# EAGLE schematic Schematic (EAGLE 6.6.0)
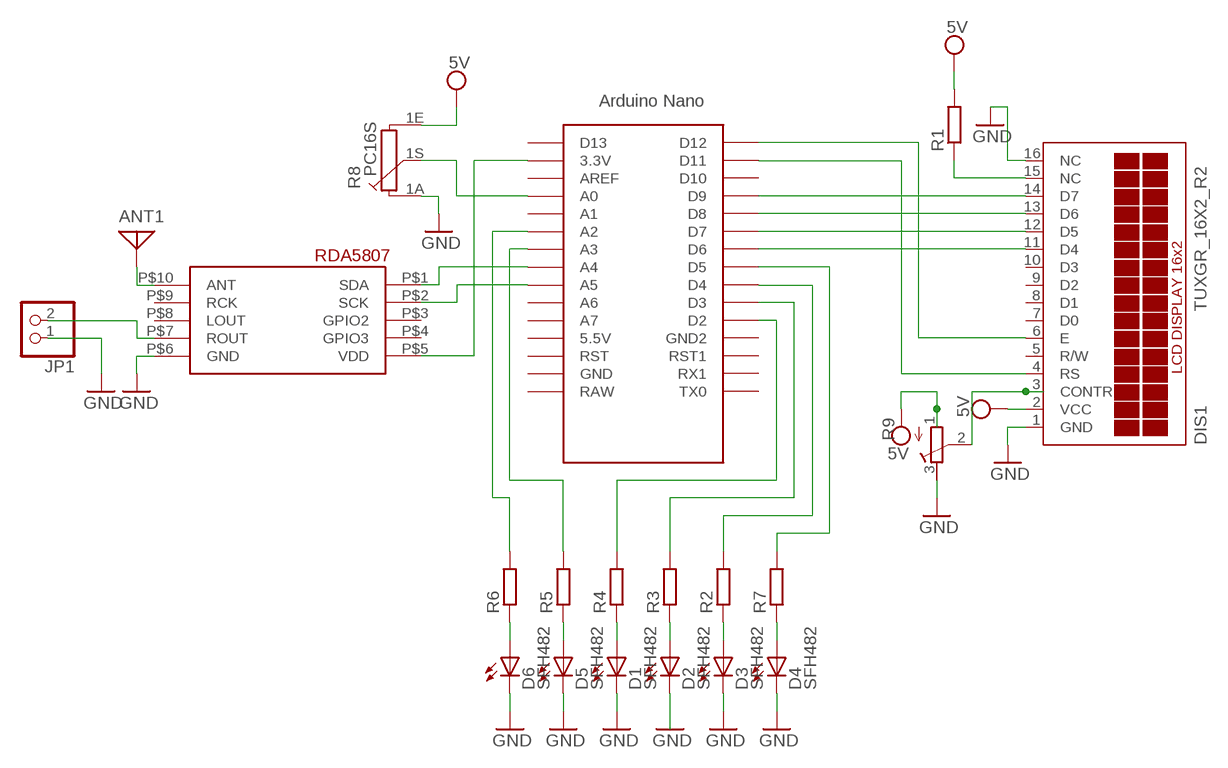
[diagram p0: schematic, sheet 1]

## Parts
ANT1  ANTENNA  [PAD-01]
D1  SFH482  [SFH482]
D2  SFH482  [SFH482]
D3  SFH482  [SFH482]
D4  SFH482  [SFH482]
D5  SFH482  [SFH482]
D6  SFH482  [SFH482]
DIS1  TUXGR_16X2_R2  [TUXGR_16X2_R2]
JP1  PINHD-1X2  [1X02]
R1  R-EU_0207/10  [0207/10]
R2  R-EU_0207/10  [0207/10]
R3  R-EU_0207/10  [0207/10]
R4  R-EU_0207/10  [0207/10]
R5  R-EU_0207/10  [0207/10]
R6  R-EU_0207/10  [0207/10]
R7  R-EU_0207/10  [0207/10]
R8  PC16S  [PC16S]
R9  R-TRIMM3339P  [RTRIM3339P]
U$1  NANO  [NANO]
U$3  RDA5807  [RDA5807]

## Nets
GND: D1.K(C) D2.K(C) D3.K(C) D4.K(C) D5.K(C) D6.K(C) DIS1.1(GND) DIS1.16(NC) JP1.1 R8.1A R9.3(A) U$3.P$6(GND)
N$1: D6.A R6.1
N$2: D5.A R5.1
N$3: D1.A R4.1
N$4: D2.A R3.1
N$5: D3.A R2.1
N$6: D4.A R7.1
N$7: DIS1.11(D4) U$1.D6
N$8: U$1.A5 U$3.P$2(SCK)
N$9: JP1.2 U$3.P$7(ROUT)
N$10: DIS1.12(D5) U$1.D7
N$11: R8.1S U$1.A0
N$12: DIS1.13(D6) U$1.D8
N$13: DIS1.14(D7) U$1.D9
N$14: DIS1.3(CONTR) R9.2(S)
N$15: DIS1.6(E) U$1.D12
N$16: DIS1.4(RS) U$1.D11
N$17: R4.2 U$1.D2
N$18: R3.2 U$1.D3
N$19: R2.2 U$1.D4
N$20: R7.2 U$1.D5
N$21: R5.2 U$1.A3
N$22: R6.2 U$1.A2
N$24: DIS1.15(NC) R1.1
N$28: U$1.3.3V U$3.P$5(VDD)
N$29: ANT1.1 U$3.P$10(ANT)
N$33: U$1.A4 U$3.P$1(SDA)
VSS: DIS1.2(VCC) R1.2 R8.1E R9.1(E) ; supply symbol labelled 5V
Unconnected: DIS1.5(R/W) DIS1.7(D0) DIS1.8(D1) DIS1.9(D2) DIS1.10(D3) U$1.5V(5.5V) U$1.A1 U$1.A6 U$1.A7 U$1.AREF U$1.D10 U$1.D13 U$1.GND U$1.GND1(GND2) U$1.ICSP1 U$1.ICSP2 U$1.ICSP3 U$1.ICSP4 U$1.ICSP5 U$1.ICSP6 U$1.RAW U$1.RST U$1.RST1 U$1.RX1 U$1.TX0 U$3.P$3(GPIO2) U$3.P$4(GPIO3) U$3.P$8(LOUT) U$3.P$9(RCK)

## Library data of the parts
ANT1 = discrete:ANTENNA: Antenna
D1-D6 = led:SFH482: IR LED infrared emitting diode, Infineon
DIS1 = display-lcd:TUXGR_16X2_R2: Tuxgraphics LCD display 16x2 characters reflective, without background light Source: tuxgr_12x2_r2.pdf; OC_FARNELL: unknown; OC_NEWARK: unknown
JP1 = pinhead:PINHD-1X2: PIN HEADER
R1-R7 = resistor:R-EU_: RESISTOR, European symbol
R8 = piher:PC16S: POTENTIOMETER single carbon potentiometer, 16 mm, S3ROH; OC_FARNELL: 4452940; OC_NEWARK: unknown
R9 = resistor6:R-TRIMM: Trimm resistor
U$1 = Arduino-clone:NANO: Arduino Nano
U$3 = rda5807:RDA5807